# EAGLE schematic state-sequencer-v0.1 (EAGLE 9.5.1)

## Sheet 1 of 2: Power Supply
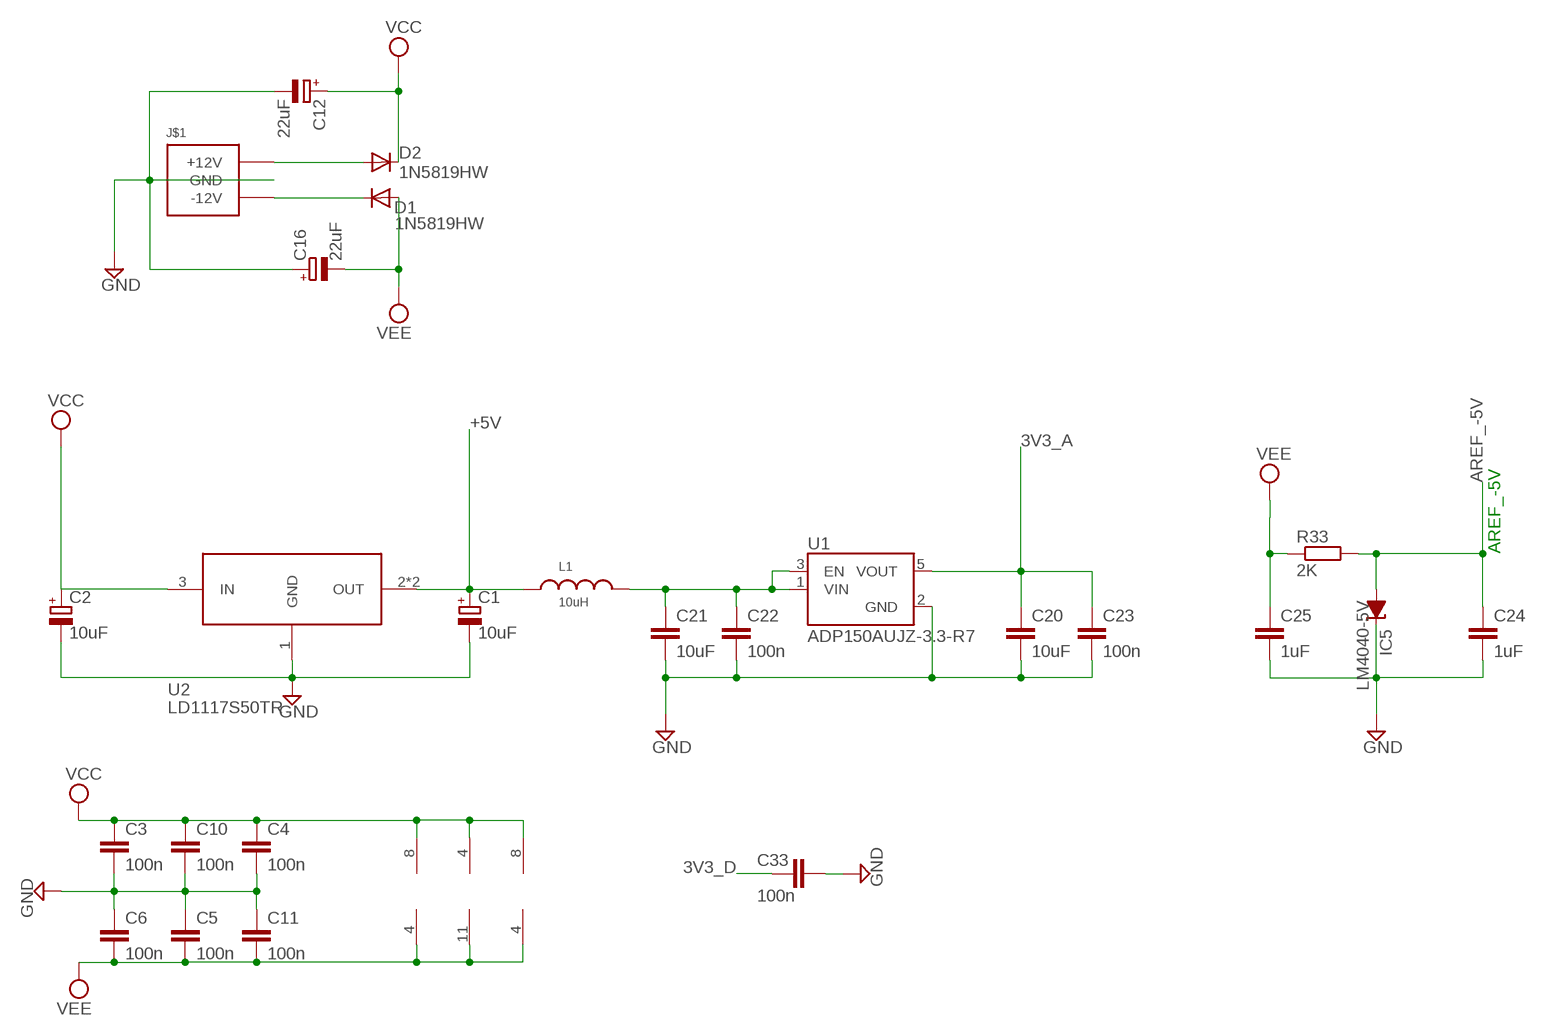
[diagram p0: schematic, sheet 1]

### Parts
C1  10uF  CPOL-EUB  [PANASONIC_B]
C2  10uF  CPOL-EUB  [PANASONIC_B]
C3  100n  C-EUC0603  [C0603]
C4  100n  C-EUC0603  [C0603]
C5  100n  C-EUC0603  [C0603]
C6  100n  C-EUC0603  [C0603]
C10  100n  C-EUC0603  [C0603]
C11  100n  C-EUC0603  [C0603]
C12  22uF  CPOL-EUC  [PANASONIC_C]
C16  22uF  CPOL-EUC  [PANASONIC_C]
C20  10uF  C-EUC1206K  [C1206K]
C21  10uF  C-EUC1206K  [C1206K]
C22  100n  C-EUC0603  [C0603]
C23  100n  C-EUC0603  [C0603]
C24  1uF  C-EUC0603  [C0603]
C25  1uF  C-EUC0603  [C0603]
C33  100n  C-EUC0603  [C0603]
D1  1N5819HW  DIODE_DIODE-SOD123  [DIODE_SOD123]
D2  1N5819HW  DIODE_DIODE-SOD123  [DIODE_SOD123]
IC1  TL072D  [SO08]
IC2  TL072D  [SO08]
IC3  TL074D  [SO14]
IC5  LM4040-5V  LM4041B12DBZ  [DBZ_R-PDSO-G3]
J$1  POWER_SIMPLE10  [POWER_10]
L1  10uH  WE-LQ_1210_744032001  [WE-LQ_M]
R33  2K  R-EU_R0603  [R0603]
U1  ADP150AUJZ-3.3-R7  [SOT95P280X100-5N]
U2  LD1117S50TR  [SOT223]

### Nets
3V3_A: C20.1 C23.1 U1.5(VOUT)
3V3_D: C33.2 ; also sheet 2
+5V: C1.+ L1.1 U2.2(OUT) U2.4(OUT)
AREF_-5V: C24.1 IC5.2(A) R33.2
GND: C1.- C2.- C3.2 C4.2 C5.1 C6.1 C10.2 C11.1 C12.- C16.+ C20.2 C21.2 C22.2 C23.2 C24.2 C25.2 C33.1 IC5.1(C) J$1.3(GND) J$1.4(GND) J$1.5(GND) J$1.6(GND) J$1.7(GND) J$1.8(GND) U1.2(GND) U2.1(GND) ; also sheet 2
N$2: D2.A J$1.9(+12V) J$1.10(+12V)
N$3: C21.1 C22.1 L1.2 U1.1(VIN) U1.3(EN)
N$41: D1.C J$1.1(-12V) J$1.2(-12V)
VCC: C2.+ C3.1 C4.1 C10.1 C12.+ D2.C IC1.8(P:V+) IC2.8(P:V+) IC3.4(P:V+) U2.3(IN)
VEE: C5.2 C6.2 C11.2 C16.- C25.1 D1.A IC1.4(P:V-) IC2.4(P:V-) IC3.11(P:V-) R33.1
Unconnected: IC1.1(A:OUT) IC1.2(A:-IN) IC1.3(A:+IN) IC1.5(B:+IN) IC1.6(B:-IN) IC1.7(B:OUT) IC2.1(A:OUT) IC2.2(A:-IN) IC2.3(A:+IN) IC2.5(B:+IN) IC2.6(B:-IN) IC2.7(B:OUT) IC3.1(A:OUT) IC3.2(A:-IN) IC3.3(A:+IN) IC3.5(B:+IN) IC3.6(B:-IN) IC3.7(B:OUT) IC3.8(C:OUT) IC3.9(C:-IN) IC3.10(C:+IN) IC3.12(D:+IN) IC3.13(D:-IN) IC3.14(D:OUT)

### Notes on the sheet
- AREF_-5V

## Sheet 2 of 2
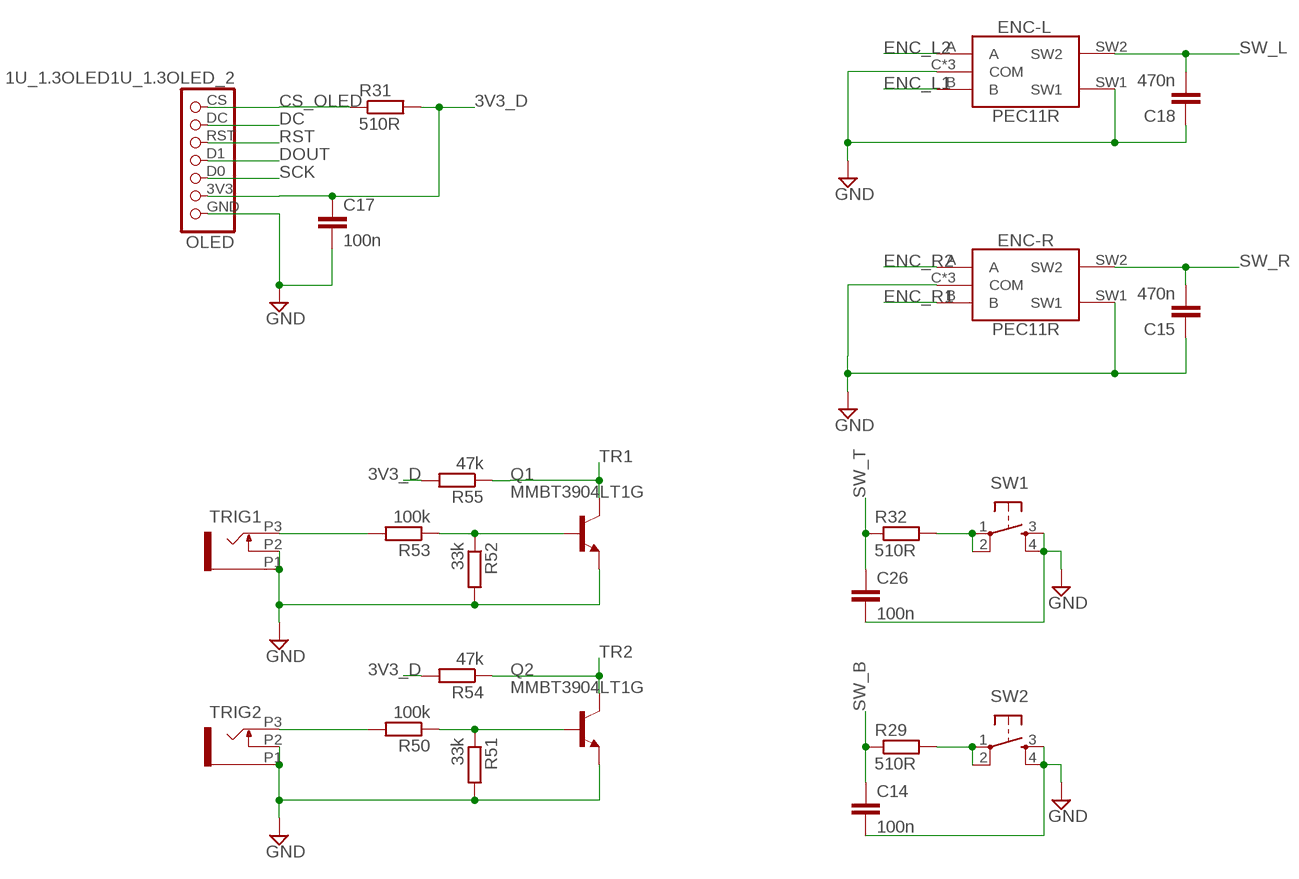
[diagram p1: schematic, sheet 2]

### Parts
C14  100n  C-EUC0603  [C0603]
C15  470n  C-EUC0603  [C0603]
C17  100n  C-EUC0603  [C0603]
C18  470n  C-EUC0603  [C0603]
C26  100n  C-EUC0603  [C0603]
ENC-L  PEC11R  [PEC11R-4XXXK-SXXXX]
ENC-R  PEC11R  [PEC11R-4XXXK-SXXXX]
OLED  1U_1.3OLED1U_1.3OLED_2  [1U_1.3OLED_2]
Q1  MMBT3904LT1G  TRANSISTOR_MMBT3904LT1-NPN-SOT23-BEC  [TRANSISTOR_SOT23-BEC]
Q2  MMBT3904LT1G  TRANSISTOR_MMBT3904LT1-NPN-SOT23-BEC  [TRANSISTOR_SOT23-BEC]
R29  510R  R-EU_R0603  [R0603]
R31  510R  R-EU_R0603  [R0603]
R32  510R  R-EU_R0603  [R0603]
R50  100k  R-EU_R0603  [R0603]
R51  33k  R-EU_R0603  [R0603]
R52  33k  R-EU_R0603  [R0603]
R53  100k  R-EU_R0603  [R0603]
R54  47k  R-EU_R0603  [R0603]
R55  47k  R-EU_R0603  [R0603]
SW1  TAC_SWITCHPTH  [TACTILE-PTH]
SW2  TAC_SWITCHPTH  [TACTILE-PTH]
TRIG1  OG-PJ301_PJ301_THONKICONN  [OG-PJ301_WQP_PJ_301M6_NO_HOLE]
TRIG2  OG-PJ301_PJ301_THONKICONN  [OG-PJ301_WQP_PJ_301M6_NO_HOLE]

### Nets
3V3_D: C17.1 OLED.3V3 R31.2 R54.2 R55.2 ; also sheet 1
CS_OLED: OLED.CS R31.1
DC: OLED.DC
DOUT: OLED.D1
ENC_L1: ENC-L.B
ENC_L2: ENC-L.A
ENC_R1: ENC-R.B
ENC_R2: ENC-R.A
GND: C14.2 C15.1 C17.2 C18.1 C26.2 ENC-L.C(COM) ENC-L.SH1(COM) ENC-L.SH2(COM) ENC-L.SW1 ENC-R.C(COM) ENC-R.SH1(COM) ENC-R.SH2(COM) ENC-R.SW1 OLED.GND Q1.E Q2.E R51.2 R52.2 SW1.3 SW1.4 SW2.3 SW2.4 TRIG1.P1 TRIG1.P2 TRIG2.P1 TRIG2.P2 ; also sheet 1
N$7: R32.2 SW1.1 SW1.2
N$9: R29.2 SW2.1 SW2.2
N$18: R53.2 TRIG1.P3
N$19: Q1.B R52.1 R53.1
N$20: R50.2 TRIG2.P3
N$21: Q2.B R50.1 R51.1
RST: OLED.RST
SCK: OLED.D0
SW_B: C14.1 R29.1
SW_L: C18.2 ENC-L.SW2
SW_R: C15.2 ENC-R.SW2
SW_T: C26.1 R32.1
TR1: Q1.C R55.1
TR2: Q2.C R54.1

## Library data of the parts
C1 C2 C12 C16 = rcl:CPOL-EU: POLARIZED CAPACITOR, European symbol; SPICEPREFIX: C
C3-C6 C10 C11 C14 C15 C17 C18 C20-C26 C33 = resistor:C-EU: CAPACITOR, European symbol
D1 D2 = elements_v02:DIODE_DIODE-: DIODE
ENC-L ENC-R = PEC11R-4215K-S0024:PEC11R: Incremental encoder 24 detents 24 pulses Bourns 24 Pulse Incremental Mechanical Rotary Encoder with a 6 mm Flat Shaft (Not Indexed), Through Hole Source: Datasheet <http://uk.rs-online.com/web/p/products/7377742>; ALLIED_NUMBER: 70407906; ALLIED_PRICE-STOCK: https://www.alliedelec.com/bourns-pec11r-4215k-s0024/70407906/; ARROW_PART_NUMBER: PEC11R-4215K-S0024; ARROW_PRICE-STOCK: http://uk.rs-online.com/web/p/products/1674651; DESCRIPTION: Incremental encoder 24 detents 24 pulses Bourns 24 Pulse Incremental Mechanical Rotary Encoder with a 6 mm Flat Shaft (Not Indexed), Through Hole; HEIGHT: mm; MANUFACTURER_NAME: Bourns; MANUFACTURER_PART_NUMBER: PEC11R-4215K-S0024; RS_PART_NUMBER: 1674651; RS_PRICE-STOCK: http://uk.rs-online.com/web/p/products/1674651
IC1 IC2 = linear:TL072: OP AMP
IC3 = linear:TL074: OP AMP
IC5 = texas:LM4041: PRECISION MICROPOWER SHUNT VOLTAGE REFERENCE Source: http://focus.ti.com/lit/ds/slcs146e/slcs146e.pdf; MPN: LM4041B12IDBZR; OC_FARNELL: 1575212; OC_NEWARK: 58K5882
J$1 = EurorackModularParts:POWER_SIMPLE
L1 = Wurth_Elektronik_Passive_rev17b:WE-LQ_1210: SMD Inductor Characteristics Miniature chip inductor wound on a special ferrite core Small inductances for compact circuits High Q at high frequencies Low DC-resistance Operating temperature: –40 ºC to +125 ºC Applications Low power DC/DC-converters from Linear Technology, National Semiconductor, Texas Instruments, Fairchild Semiconductor, ON Semiconductor, STMicroelectronics, Maxim, MPS, Semtech, Exar, Analogic Tech, Diodes and Cologne Chip EMI-Filtering RF-circuits <http://katalog.we-online.de/media/images/eisos/IndLQ_pf2.jpg> Details see: http://katalog.we-online.de/en/pbs/WE-LQ? Updated by Dan Xu 2014-07-08 2014 (C) Wurth Elektronik; WE-NUMBER: 744032001/1uH
OLED = 1U_1.3oled:1U_1.3OLED
Q1 Q2 = braids_v50:TRANSISTOR_*-NPN-: NPN Transistror BF959 corrected 2008.03.06
R29 R31-R33 R50-R55 = rcl:R-EU_: RESISTOR, European symbol; SPICEPREFIX: R
SW1 SW2 = SparkFun:TAC_SWITCH: Momentary Switch Button commonly used for reset or general input. Spark Fun Electronics SKU : COM-00097
TRIG1 TRIG2 = SHAY_THONKICONNS:OG-PJ301_PJ301_THONKICONN
U1 = ADP150AUJZ-2.3-R7:ADP150AUJZ-3.3-R7: IC REG LINEAR 2V 150MA 5TSOT; AVAILABILITY: Good; DESCRIPTION: LDO Regulator Pos 2V 0.15A 5-Pin TSOT T/R; MF: Analog Devices; MP: ADP150AUJZ-2.0-R7; PACKAGE: TSOT-23 Analog Devices; PRICE: 0.65 USD
U2 = LD1117S50TR:LD1117S50TR: http://octopart.com/ld1117s50tr-stmicroelectronics-529395; AVAILABILITY: Good; DESCRIPTION: LD1117 Series 1300 mA 5 V Fixed Output Positive Voltage LDO Regulator - SOT-223; MF: STMicroelectronics; MP: LD1117S50TR; PACKAGE: SOT-223 STMicroelectronics; PRICE: 0.19 USD